# EasyEDA Pro project ProPrj_TPS双路降压模块_2025-07-25.epro

# Schematic Schematic1
Board Name: Board1; Create Date: 2025-07-24; Page Name: P1; Project Name: TPS双路降压模块; Schematic Name: Schematic1; Update Date: 2025-07-24; Company: 嘉立创EDA; Page Size: A4; Version: V1.0
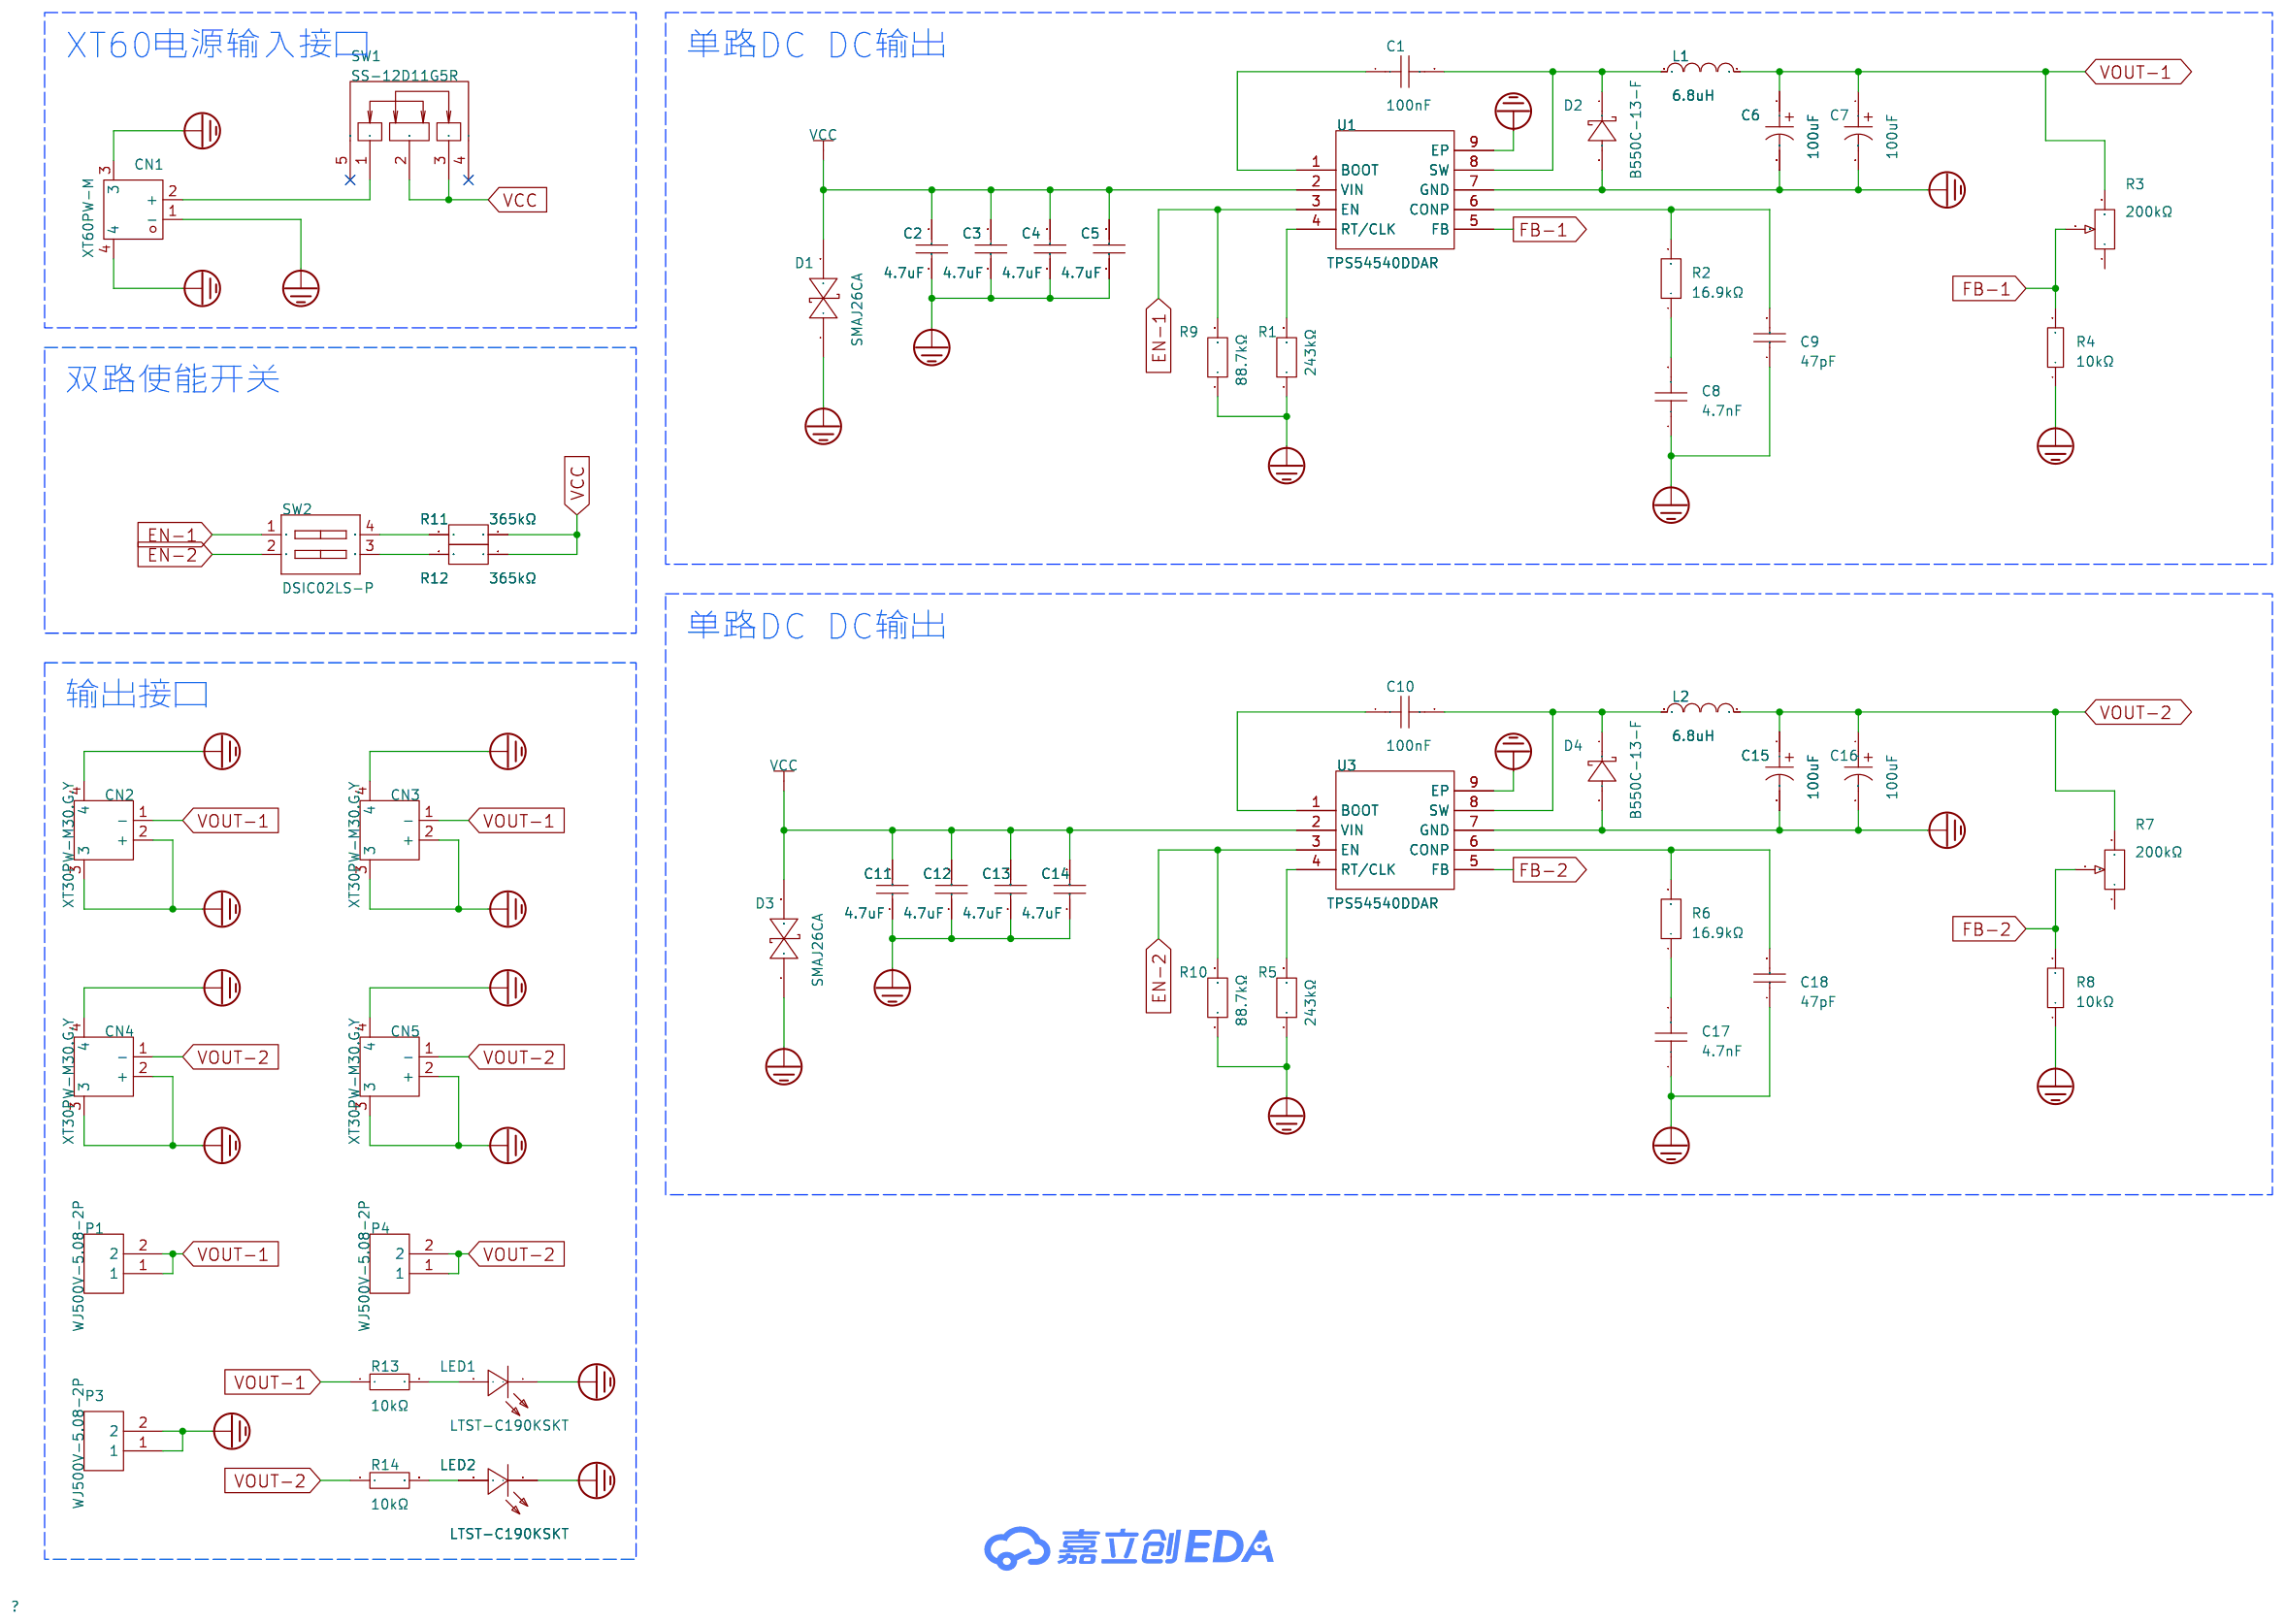
[diagram p0: schematic sheet]

## Parts
C1  100nF  [C0603]
C2  4.7uF  [C0805]
C3  4.7uF  [C0805]
C4  4.7uF  [C0805]
C5  4.7uF  [C0805]
C6  100uF  [CAP-TH_BD8.0-P3.50-D0.6-FD]
C7  100uF  [CAP-TH_BD8.0-P3.50-D0.6-FD]
C8  4.7nF  [C0603]
C9  47pF  [C0603]
C10  100nF  [C0603]
C11  4.7uF  [C0805]
C12  4.7uF  [C0805]
C13  4.7uF  [C0805]
C14  4.7uF  [C0805]
C15  100uF  [CAP-TH_BD8.0-P3.50-D0.6-FD]
C16  100uF  [CAP-TH_BD8.0-P3.50-D0.6-FD]
C17  4.7nF  [C0603]
C18  47pF  [C0603]
CN1  XT60PW-M  [CONN-TH_XT60PW-M]
CN2  XT30PW-M30.G.Y  [CONN-TH_XT30PW-M]
CN3  XT30PW-M30.G.Y  [CONN-TH_XT30PW-M]
CN4  XT30PW-M30.G.Y  [CONN-TH_XT30PW-M]
CN5  XT30PW-M30.G.Y  [CONN-TH_XT30PW-M]
D1  SMAJ26CA  [SMA_L4.4-W2.6-LS5.0-BI]
D2  B550C-13-F  [SMC_L6.9-W5.9-LS7.9-RD]
D3  SMAJ26CA  [SMA_L4.4-W2.6-LS5.0-BI]
D4  B550C-13-F  [SMC_L6.9-W5.9-LS7.9-RD]
L1  6.8uH  [IND-SMD_L7.0-W6.6]
L2  6.8uH  [IND-SMD_L7.0-W6.6]
LED1  LTST-C190KSKT  [LED0603-RD]
LED2  LTST-C190KSKT  [LED0603-RD]
P1  WJ500V-5.08-2P  [CONN-TH_2P-P5.00_WJ500V-5.08-2P]
P3  WJ500V-5.08-2P  [CONN-TH_2P-P5.00_WJ500V-5.08-2P]
P4  WJ500V-5.08-2P  [CONN-TH_2P-P5.00_WJ500V-5.08-2P]
R1  243kΩ  [R0603]
R2  16.9kΩ  [R0603]
R3  200kΩ  [RES-ADJ-TH_3P-L7.1-W6.9-P2.50-L_3362P]
R4  10kΩ  [R0603]
R5  243kΩ  [R0603]
R6  16.9kΩ  [R0603]
R7  200kΩ  [RES-ADJ-TH_3P-L7.1-W6.9-P2.50-L_3362P]
R8  10kΩ  [R0603]
R9  88.7kΩ  [R0603]
R10  88.7kΩ  [R0603]
R11  365kΩ  [R0603]
R12  365kΩ  [R0603]
R13  10kΩ  [R0603]
R14  10kΩ  [R0603]
SW1  SS-12D11G5R  [SW-TH_SS-12D11G5R]
SW2  DSIC02LS-P  [SW-SMD_4P-L5.1-W6.1-P2.54-LS9.8]
U1  TPS54540DDAR  [SOIC-8_L4.9-W3.9-P1.27-LS6.0-BL-EP]
U3  TPS54540DDAR  [SOIC-8_L4.9-W3.9-P1.27-LS6.0-BL-EP]

## Library data of the parts
C1 C10 = CGA0603X7R104K500JT: 容值:100nF;精度:±10%;额定电压:50V;温度系数:X7R;; LCSC Part Name: 100nF ±10% 50V; Supplier Part: C6119867; Manufacturer: HRE(芯声); Supplier Footprint: 0603; JLCPCB Part Class: 扩展库; Datasheet: https://atta.szlcsc.com/upload/public/pdf/source/20250103/C44077DA9E7B3EFAE02F22B6D3D1CBC9.pdf; Supplier: LCSC; Tolerance: ±10%; Voltage Rating: 50V; Temperature Coefficient: X7R
C2-C5 C11-C14 = CL21A475KBQNNNE: 容值:4.7uF;精度:±10%;额定电压:50V;材质(温度系数):X5R;; LCSC Part Name: 4.7uF ±10% 50V; Supplier Part: C98192; Manufacturer: SAMSUNG(三星); Supplier Footprint: 0805; JLCPCB Part Class: 扩展库; Datasheet: https://atta.szlcsc.com/upload/public/pdf/source/20160218/1457707763339.pdf; Supplier: LCSC; Tolerance: ±10%; Voltage Rated: 50V; Temperature Coefficient: X5R
C6 C7 C15 C16 = PA50V100M8x8: 容值:100uF;精度:±20%;额定电压:50V;纹波电流:2.9A@100kHz;等效串联电阻(ESR):30mΩ@100kHz;类型:聚合物;; LCSC Part Name: 100uF ±20% 50V; Supplier Part: C46550427; Manufacturer: 捷而瑞; Supplier Footprint: 插件,D8xL8mm; JLCPCB Part Class: 扩展库; Datasheet: https://atta.szlcsc.com/upload/public/pdf/source/20250307/831193F737CAF6D75AC25F14E955F0EC.pdf; Supplier: LCSC; Tolerance: ±20%; Voltage Rating: 50V; Ripple Current: 2.9A@100kHz; Equivalent Series Resistance(ESR): 30mΩ@100kHz; Type: 聚合物; Diameter: 8mm; Height - Seated (Max): 8mm; Lifetime: 2000hrs@105℃; Operating Temperature: -55℃~+105℃
C8 C17 = CGA0603X7R472K500JT: 容值:4.7nF;精度:±10%;额定电压:50V;温度系数:X7R;; LCSC Part Name: 4.7nF ±10% 50V; Supplier Part: C7503499; Manufacturer: HRE(芯声); Supplier Footprint: 0603; JLCPCB Part Class: 扩展库; Supplier: LCSC; Tolerance: ±10%; Voltage Rating: 50V; Temperature Coefficient: X7R
C9 C18 = CL10C470JB8NNNC: 容值:47pF;精度:±5%;额定电压:50V;材质(温度系数):C0G;; LCSC Part Name: 47pF ±5% 50V; Supplier Part: C1671; Manufacturer: SAMSUNG(三星); Supplier Footprint: 0603; JLCPCB Part Class: 基础库; Datasheet: https://atta.szlcsc.com/upload/public/pdf/source/20160218/1457707763339.pdf; Supplier: LCSC; Tolerance: ±5%; Voltage Rated: 50V; Temperature Coefficient: C0G
CN1 = XT60PW-M: 类别:-;类型1:-;; LCSC Part Name: AMASS(艾迈斯)航模插头xt60连接器150公母对接pw锂电池公头 板插卧式XT60PW-M; Supplier Part: C98732; Manufacturer: AMASS(艾迈斯); JLCPCB Part Class: 扩展库; Datasheet: https://atta.szlcsc.com/upload/public/pdf/source/20240118/44A3DCFF53BE25DC65378AFFB21277A4.pdf; Supplier: LCSC; Type: 卧式插头; Colour: 黄色; InterfaceType: 公头
CN2-CN5 = XT30PW-M30.G.Y: 类别:-;类型1:-;; LCSC Part Name: AMASS(艾迈斯)航模插头 卧式弯脚 XT30PW-M公头; Supplier Part: C431092; Manufacturer: AMASS(艾迈斯); JLCPCB Part Class: 扩展库; Datasheet: https://atta.szlcsc.com/upload/public/pdf/source/20220222/6A9F22F7850E25B33E1BE430ADF8560B.pdf; Supplier: LCSC; Type: 航模插头; RatedVoltage: DC 500V; InterfaceType: 公头; RatedCurrent: 15A; RecommendedWireGauge: 16/18/20AWG; contact resistance: 1.2mΩ; specifications: 2pin
D1 D3 = SMAJ26CA_C173517: 反向截止电压(Vrwm):26V;最大钳位电压:42.1V;峰值脉冲电流(Ipp)@10/1000us:9.5A;击穿电压:28.9V;; Supplier Part: C173517; Manufacturer: MDD; Supplier Footprint: SMA(DO-214AC); JLCPCB Part Class: 扩展库; Datasheet: https://atta.szlcsc.com/upload/public/pdf/source/20230314/4319D8044EE29783A53F6AC60595AA71.pdf; Supplier: LCSC; Reverse Stand-Off Voltage (Vrwm): 26V; Maximum Clamping Voltage: 42.1V; Peak Pulse Current (Ipp)@10/1000us: 9.5A; Breakdown Voltage: 28.9V; Reverse Leakage Current (Ir): 1uA; Type: TVS
D2 D4 = B550C-13-F: 二极管配置:-;正向压降(Vf):575mV@5A;直流反向耐压(Vr):50V;整流电流:5A;; LCSC Part Name: 电压:50V 电流:5A; Supplier Part: C134461; Manufacturer: DIODES(美台); Supplier Footprint: SMC(DO-214AB); JLCPCB Part Class: 扩展库; Datasheet: https://atta.szlcsc.com/upload/public/pdf/source/20171023/C134461_15087453602301052556.pdf; Supplier: LCSC; Forward Voltage (Vf@If): 575mV@5A; Reverse Voltage (Vr): 50V; Rectified Current: 5A; Reverse Leakage Current (Ir): 500uA@50V
L1 L2 = FXL0630-6R8-M: 电感值:6.8uH;精度:±20%;额定电流:5A;饱和电流(Isat):6A;类型:一体成型电感;; LCSC Part Name: 6.8uH ±20% 6A; Supplier Part: C167221; Manufacturer: cjiang(长江微电); Supplier Footprint: SMD,6.6x7mm; JLCPCB Part Class: 扩展库; Datasheet: https://atta.szlcsc.com/upload/public/pdf/source/20240426/3189EA8206330E2108542F9E34E540E7.pdf; Supplier: LCSC; Tolerance: ±20%; Rated Current: 5A; Saturation Current (Isat): 6A; DC Resistance (DCR): 48mΩ; Type: 一体成型电感
LED1 LED2 = LTST-C190KSKT: 发光颜色:黄色;正向电压(VF):2.1V;功率:75mW;正向电流:20mA;主波长:584.5nm~597nm;二极管配置:-;透镜颜色:无色透明透镜;色温:-;发光强度:104mcd;发光角度:130°;载带方式:-;工作温度:-30℃~+85℃;; LCSC Part Name: 黄灯; Supplier Part: C125095; Manufacturer: LITEON(光宝); Supplier Footprint: 0603; JLCPCB Part Class: 扩展库; Datasheet: https://atta.szlcsc.com/upload/public/pdf/source/20180129/C125095_15171881843821315881.pdf; Supplier: LCSC; Emitted Color: 黄色; Forward Voltage (VF): 2.1V; Power Dissipation: 75mW; Forward Current: 20mA; Dominant Wavelength: 584.5nm~597nm; Peak Wavelength: 588nm; Lens Color: 无色透明透镜; Luminous Intensity: 104mcd; Viewing Angle: 130°; Operating Temperature: -30℃~+85℃
P1 P3 P4 = WJ500V-5.08-2P: 结构:1x2P;间距:5.08mm;颜色:绿色;安装方式:直插;额定电流:18A;额定电压:250V;排数:1;线规 - AWG:14~30;线规 - 平方毫米:2.5;每排PIN数:2;触头材质:-;触头镀层:-;工作温度范围:-40℃~+105℃;焊接温度(最大值):-;; LCSC Part Name: 1x2P 5.08mm 直插 排数:1 每排P数:2; Supplier Part: C8465; Manufacturer: KANGNEX(康奈克斯电气); Supplier Footprint: 插件,P=5.08mm; JLCPCB Part Class: 扩展库; Datasheet: https://atta.szlcsc.com/upload/public/pdf/source/20191225/C8465_02D34CE5B5B4A53DF5891601D97FA9F4.pdf; Supplier: LCSC; Structure: 1x2P; Pitch: 5.08mm; Color: 绿色; Mounting Style: 直插; Current Rating (Max): 18A; Voltage Rating (Max): 250V; Number of Pins: 2P; Number of Rows: 1; Wire Gauge - AWG: 14~30; Wire Gauge - mm2: 2.5; Number of PINs Per Row: 2; Operating Temperature Range: -40℃~+105℃; Screw Specification: M2.5
R1 R5 = RT0603BRD07243KL: 电阻类型:薄膜电阻;阻值:243kΩ;精度:±0.1%;功率:100mW;温度系数:±25ppm/℃;; LCSC Part Name: 薄膜电阻 243kΩ ±0.1% 100mW; Supplier Part: C861248; Manufacturer: YAGEO(国巨); Supplier Footprint: 0603; JLCPCB Part Class: 扩展库; Datasheet: https://atta.szlcsc.com/upload/public/pdf/source/20200610/C326738_5639A9F1B6EB6E4AE2197577D3456E7F.pdf; Supplier: LCSC; Type: 薄膜电阻; Tolerance: ±0.1%; Power(Watts): 100mW; Temperature Coefficient: ±25ppm/℃; Operating Temperature: -55℃~+155℃
R2 R6 = RT0603BRD0716K9L: 电阻类型:薄膜电阻;阻值:16.9kΩ;精度:±0.1%;功率:100mW;温度系数:±25ppm/℃;; LCSC Part Name: 薄膜电阻 16.9kΩ ±0.1% 100mW; Supplier Part: C861156; Manufacturer: YAGEO(国巨); Supplier Footprint: 0603; JLCPCB Part Class: 扩展库; Datasheet: https://atta.szlcsc.com/upload/public/pdf/source/20200610/C326738_5639A9F1B6EB6E4AE2197577D3456E7F.pdf; Supplier: LCSC; Type: 薄膜电阻; Tolerance: ±0.1%; Power(Watts): 100mW; Temperature Coefficient: ±25ppm/℃; Operating Temperature Range: -55℃~+155℃
R3 R7 = 3362P-1-204: 阻值:200kΩ;精度:±10%;; LCSC Part Name: 200kΩ ±10%; Supplier Part: C118941; Manufacturer: BOCHEN(博晨); Supplier Footprint: 插件; JLCPCB Part Class: 扩展库; Datasheet: https://atta.szlcsc.com/upload/public/pdf/source/20171114/C118941_15106326619261117430.pdf; Supplier: LCSC; Tolerance: ±10%
R4 R8 R13 R14 = 0603WAF1002T5E: 电阻类型:厚膜电阻;阻值:10kΩ;精度:±1%;功率:100mW;工作电压:75V;温度系数:±100ppm/℃;; LCSC Part Name: 厚膜电阻 10kΩ ±1% 100mW; Supplier Part: C25804; Manufacturer: UNI-ROYAL(厚声); Supplier Footprint: 0603; JLCPCB Part Class: 基础库; Datasheet: https://atta.szlcsc.com/upload/public/pdf/source/20200306/C422600_1E6D84923E4A46A82E41ADD87F860B5C.pdf; Supplier: LCSC; Type: 厚膜电阻; Tolerance: ±1%; Power(Watts): 100mW; Voltage-Supply(Max): 75V; Temperature Coefficient: ±100ppm/℃; Operating Temperature: -55℃~+155℃
R9 R10 = FRC0603F8872TS: 电阻类型:厚膜电阻;阻值:88.7kΩ;精度:±1%;功率:100mW;最大工作电压:75V;温度系数:±100ppm/℃;; LCSC Part Name: 88.7kΩ ±1% 100mW 厚膜电阻; Supplier Part: C2999456; Manufacturer: FOJAN(富捷); Supplier Footprint: 0603; JLCPCB Part Class: 扩展库; Datasheet: https://atta.szlcsc.com/upload/public/pdf/source/20211221/925EC7D7225764EE0046F22065062C87.pdf; Supplier: LCSC; Type: 厚膜电阻; Tolerance: ±1%; Power(Watts): 100mW; Overload Voltage (Max): 75V; Temperature Coefficient: ±100ppm/℃
R11 R12 = RT0603BRE07365KL: 电阻类型:薄膜电阻;阻值:365kΩ;精度:±0.1%;功率:100mW;最大工作电压:75V;温度系数:±50ppm/℃;; LCSC Part Name: 薄膜电阻 365kΩ ±0.1% 100mW; Supplier Part: C705852; Manufacturer: YAGEO(国巨); Supplier Footprint: 0603; JLCPCB Part Class: 扩展库; Datasheet: https://atta.szlcsc.com/upload/public/pdf/source/20200720/C705852_E6A0549579C0A9487495768CA46BD90A.pdf; Supplier: LCSC; Type: 薄膜电阻; Tolerance: ±0.1%; Power(Watts): 100mW; Overload Voltage (Max): 75V; Temperature Coefficient: ±50ppm/℃; Operating Temperature Range: -55℃~+155℃
SW1 = SS-12D11G5R: 电路结构:单刀双掷;安装方式:弯插;开关颜色:黑色;额定电流(DC):5A;额定电压(DC):125V;额定电流(AC):5A;额定电压(AC):125V;机械寿命:1万次;; LCSC Part Name: 柄长5mm 弯插双档 滑动开关; Supplier Part: C388633; Manufacturer: XKB Connectivity(中国星坤); Supplier Footprint: 插件; JLCPCB Part Class: 扩展库; Datasheet: https://atta.szlcsc.com/upload/public/pdf/source/20211009/84F89DEF741E27E9E55DE4039DC07CAD.pdf; Supplier: LCSC; Circuit: 单刀双掷; Actuator Style: 矩形柱状; Pin Style: PC引脚; Switch Length: 13.5mm; Switch Width: 6.6mm; Switch Height: 6.3mm; Mounting Style: 弯插; Actuator Color: 黑色; Current Rating (DC): 5A; Voltage Rating (DC): 125V; Current Rating (AC): 5A; Voltage Rating (AC): 125V; Mechanical Life: 1万次; Operating Temperature: -40℃~+85℃
SW2 = DSIC02LS-P_C489174: 类型:平拨,凸起式;电路结构:单刀单掷;开关位数:2位;额定电流:25mA;额定电压:24V;使用寿命:3千次;颜色:黑色;; LCSC Part Name: 间距2.54mm 平拨,凸起式 2位拨码开关; Supplier Part: C489174; Manufacturer: XKB Connectivity(中国星坤); Supplier Footprint: SMD-4P,5.1x6.1mm; JLCPCB Part Class: 扩展库; Datasheet: https://atta.szlcsc.com/upload/public/pdf/source/20200227/C424380_7B5FE7C891E0521A8B96890FFC9096F0.pdf; Supplier: LCSC; Type: 平拨,凸起式; Circuit: 单刀单掷; Number of Positions: 2位; Pin Style: 鸥翼型; Lead Pitch: 2.54mm; Current Rating: 25mA; Voltage Rating: 24V; Operating Temperature: -20℃~+70℃; Operating Life: 3千次; Color: 黑色
U1 U3 = TPS54540DDAR: 功能类型:降压型;输出类型:可调;工作电压:4.5V~42V;输出电压:800mV~41.1V;输出电流:5A;; LCSC Part Name: 4.5V至42V输入、5A降压直流/直流转换器; Supplier Part: C95286; Manufacturer: TI(德州仪器); Supplier Footprint: SOIC-8-EP; JLCPCB Part Class: 扩展库; Datasheet: https://www.ti.com/cn/lit/gpn/tps54540; Supplier: LCSC; Function: 降压型; Output Type: 可调; Input Voltage: 4.5V~42V; Output Voltage: 800mV~41.1V; Output Current: 5A; Switching Frequency: 2.5MHz; Operating Temperature: -40℃~+150℃@(TJ); Synchronous Rectification: 否; Number of Outputs: 1; Topology: 降压式; Switch tube (built-in/external): 内置

## Nets
PGND: C2.1 C3.1 C4.1 C5.1 C6.2 C7.2 C8.1 C9.1 C11.1 C12.1 C13.1 C14.1 C15.2 C16.2 C17.1 C18.1 CN1.1(-) CN1.3 CN1.4 CN2.2(+) CN2.3 CN2.4 CN3.2(+) CN3.3 CN3.4 CN4.2(+) CN4.3 CN4.4 CN5.2(+) CN5.3 CN5.4 D1.1 D2.2(A) D3.1 D4.2(A) LED1.1(-) LED2.1(-) P3.1 P3.2 R1.1 R4.1 R5.1 R8.1 R9.1 R10.1 U1.7(GND) U1.9(EP) U3.7(GND) U3.9(EP)
VCC: C2.2 C3.2 C4.2 C5.2 C11.2 C12.2 C13.2 C14.2 D1.2 D3.2 R11.1 R12.1 SW1.2 SW1.3 U1.2(VIN) U3.2(VIN)
EN-1: R9.2 SW2.1(A1) U1.3(EN)
EN-2: R10.2 SW2.2(A2) U3.3(EN)
FB-1: R3.2 R4.2 U1.5(FB)
FB-2: R7.2 R8.2 U3.5(FB)
VOUT-1: C6.1 C7.1 CN2.1(-) CN3.1(-) L1.2 P1.1 P1.2 R3.3 R13.1
VOUT-2: C15.1 C16.1 CN4.1(-) CN5.1(-) L2.2 P4.1 P4.2 R7.3 R14.1
$1N288: CN1.2(+) SW1.1
$1N352: C1.1 U1.1(BOOT)
$1N358: C1.2 D2.1(C) L1.1 U1.8(SW)
$1N869: R1.2 U1.4(RT/CLK)
$1N1551: C8.2 R2.1
$1N1558: C9.2 R2.2 U1.6(CONP)
$1N2638: C10.1 U3.1(BOOT)
$1N2642: C10.2 D4.1(C) L2.1 U3.8(SW)
$1N2678: R5.2 U3.4(RT/CLK)
$1N2701: C17.2 R6.1
$1N2703: C18.2 R6.2 U3.6(CONP)
$1N3232: R11.2 SW2.4(B1)
$1N3236: R12.2 SW2.3(B2)
$1N4459: LED1.2(+) R13.2
$1N4463: LED2.2(+) R14.2

Not connected (* = marked no-connect by the designer): R3 1; R7 1; SW1 4* 5*

## Notes on the sheet
- XT60电源输入接口
- 单路DC DC输出
- 双路使能开关
- 单路DC DC输出
- 输出接口

# Board PCB1
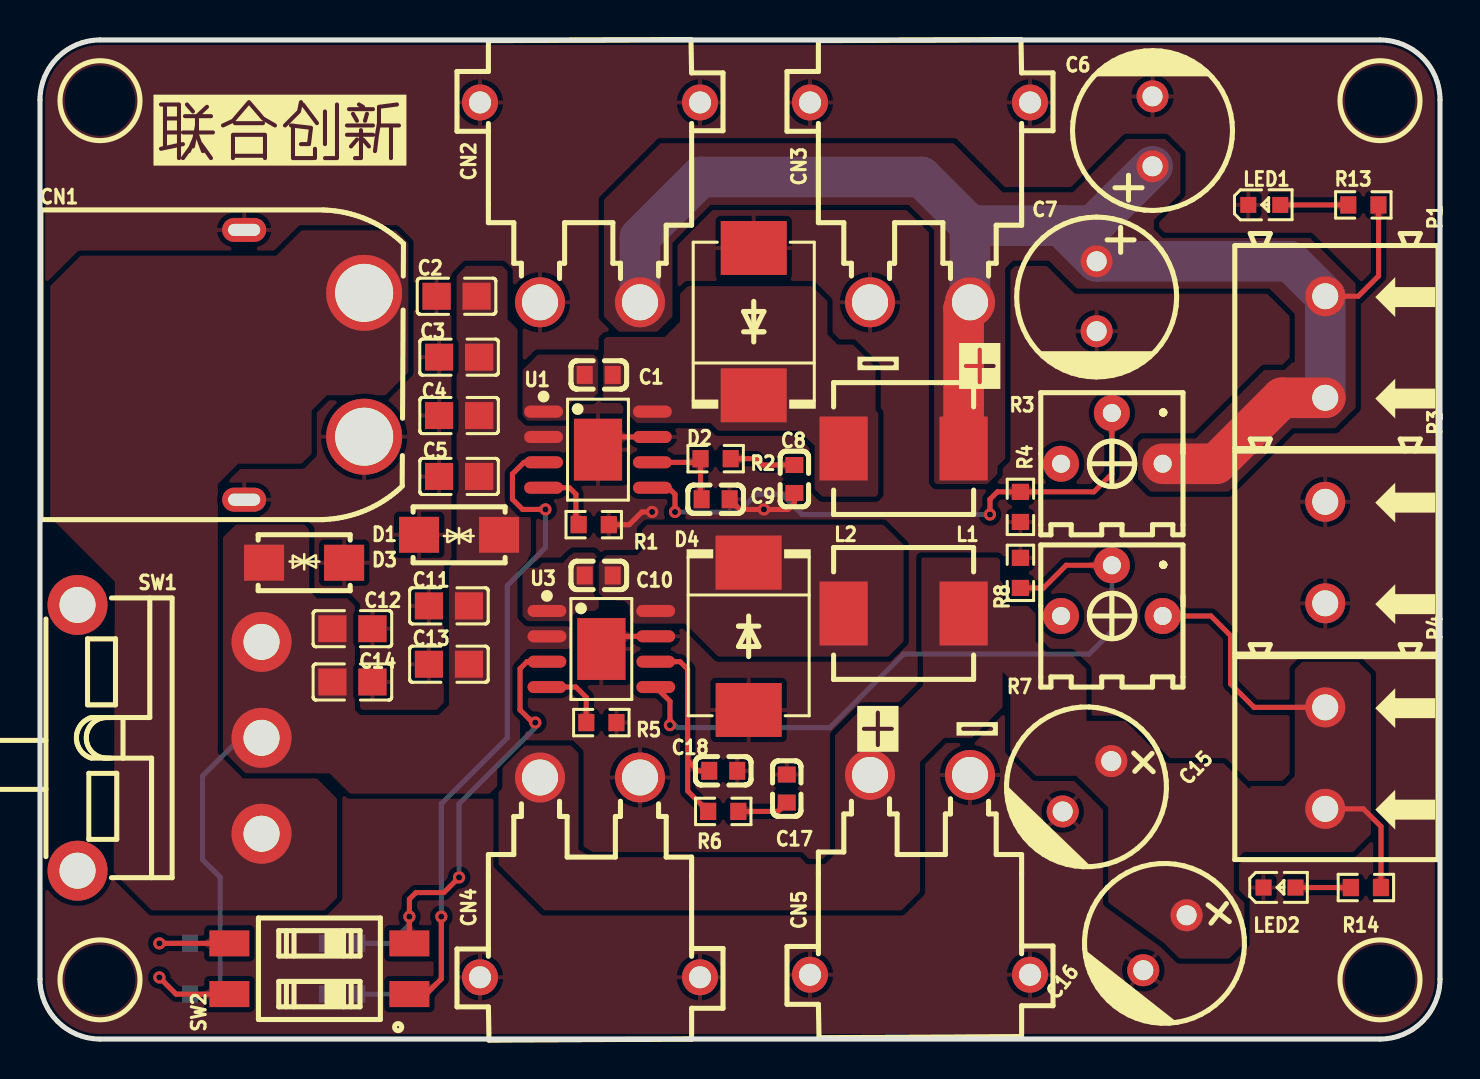
[diagram p1: board, top side]
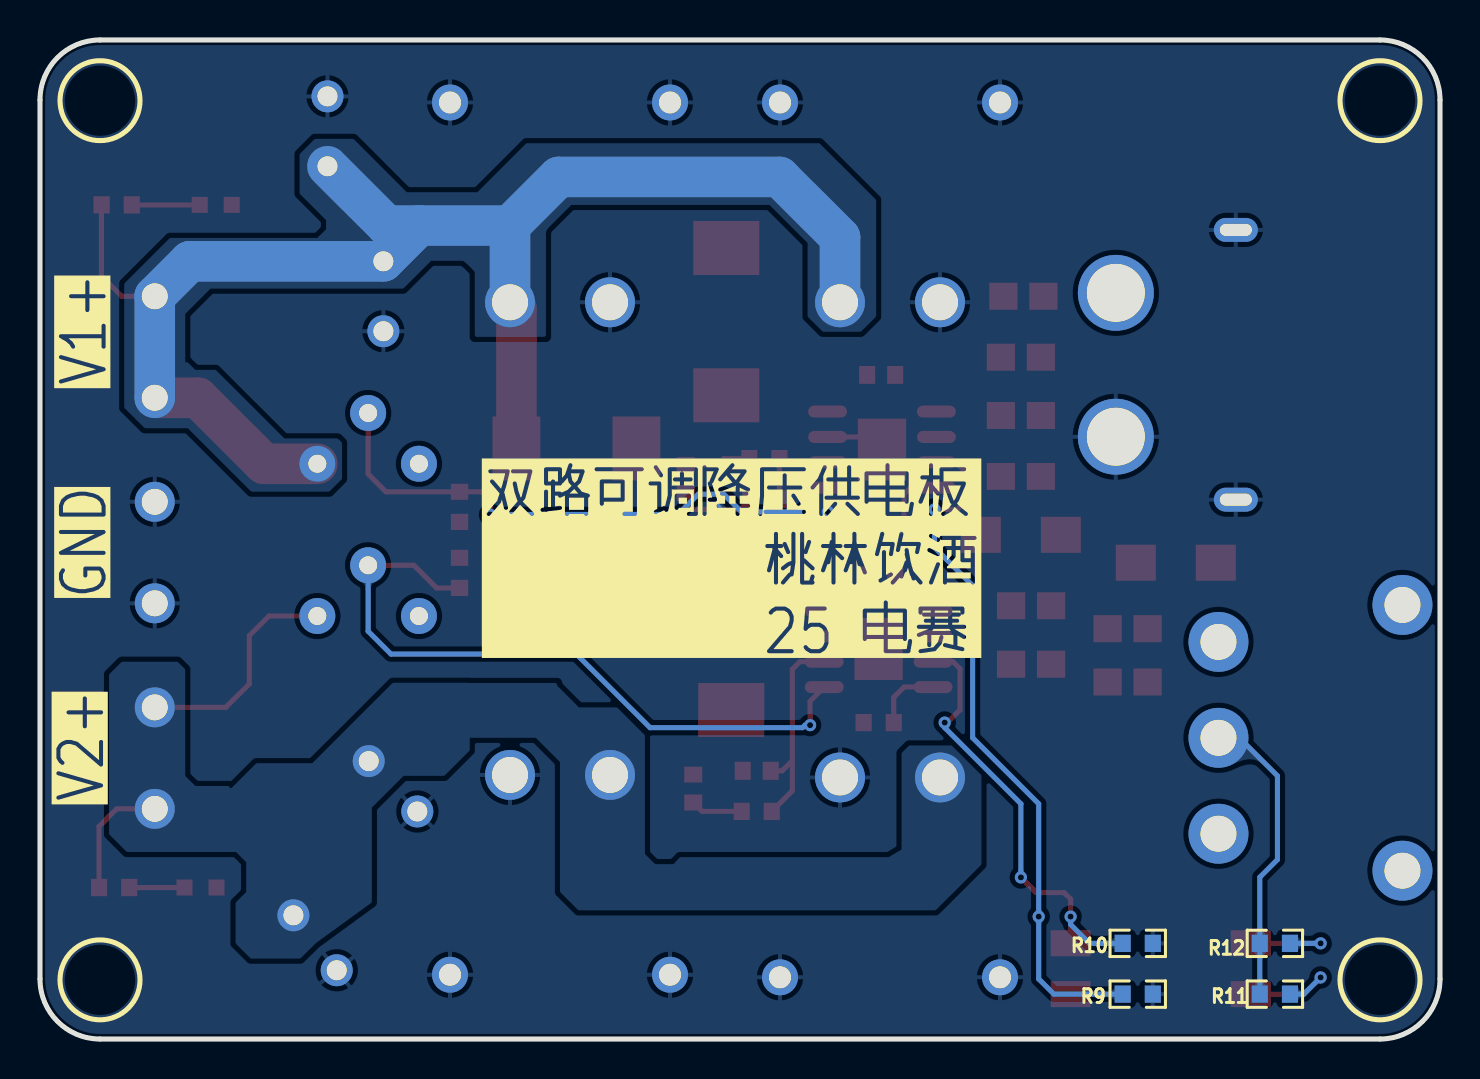
[diagram p2: board, bottom side, seen from below]

Outline 70 x 50 mm; copper layers: Top Layer, Bottom Layer. Coordinates in mm from the lower left corner of the outline.
Outline path: 0,47 0,3 arc(0.88,0.88) 3,0 67,0 arc(69.12,0.88) 70,3 70,47 arc(69.12,49.12) 67,50 3,50 arc(0.88,49.12) 0,47
Stack: Top Layer 0.035mm / Dielectric1 1.51mm FR4 er 4.5 / Bottom Layer 0.035mm

## Design rules (mm)
template: 自定义配置
spacing copperThickness1oz (default): track to track 0.102, other pairs 0.152 to 0.3
spacing copperThickness2oz: track to track 0.203, other pairs 0.152 to 0.3
track width copperThickness1oz (default): min 0.127, default 0.254, max 2.54
track width copperThickness2oz: min 0.203, default 0.254, max 2.54
differential pair differentialPair (default): width min 0.127, default 0.254, max 2.54; gap min 0.152, default 0.152
via viaSize (default): diameter min 0.5, default 0.61, max 10; hole min 0.3, default 0.305, max 6.3
net PGND uses copperRegion1

## Placement (name value [footprint] x y rotation side)
C1  100nF  [C0603]  27.94 33.24 0 top
C2  4.7uF  [C0805]  20.83 37.17 0 top
C3  4.7uF  [C0805]  20.96 34.12 0 top
C4  4.7uF  [C0805]  20.96 31.2 0 top
C5  4.7uF  [C0805]  20.96 28.16 0 top
C6  100uF  [CAP-TH_BD8.0-P3.50-D0.6-FD]  55.63 45.43 90 top
C7  100uF  [CAP-TH_BD8.0-P3.50-D0.6-FD]  52.83 37.17 270 top
C8  4.7nF  [C0603]  37.72 28.03 90 top
C9  47pF  [C0603]  33.78 27.01 180 top
C10  100nF  [C0603]  27.94 23.2 0 top
C11  4.7uF  [C0805]  20.45 21.68 0 top
C12  4.7uF  [C0805]  15.62 20.54 180 top
C13  4.7uF  [C0805]  20.45 18.76 0 top
C14  4.7uF  [C0805]  15.62 17.87 180 top
C15  100uF  [CAP-TH_BD8.0-P3.50-D0.6-FD]  52.35 12.65 226.1 top
C16  100uF  [CAP-TH_BD8.0-P3.50-D0.6-FD]  56.25 4.82 231.8 top
C17  4.7nF  [C0603]  37.34 12.53 270 top
C18  47pF  [C0603]  34.16 13.42 180 top
CN1  XT60PW-M  [CONN-TH_XT60PW-M]  13.21 33.74 0 top
CN2  XT30PW-M30.G.Y  [CONN-TH_XT30PW-M]  27.5 41.87 180 top
CN3  XT30PW-M30.G.Y  [CONN-TH_XT30PW-M]  44 41.87 180 top
CN4  XT30PW-M30.G.Y  [CONN-TH_XT30PW-M]  27.5 8.09 0 top
CN5  XT30PW-M30.G.Y  [CONN-TH_XT30PW-M]  44 8.22 0 top
D1  SMAJ26CA  [SMA_L4.4-W2.6-LS5.0-BI]  20.96 25.23 0 top
D2  B550C-13-F  [SMC_L6.9-W5.9-LS7.9-RD]  35.69 35.9 90 top
D3  SMAJ26CA  [SMA_L4.4-W2.6-LS5.0-BI]  13.21 23.84 180 top
D4  B550C-13-F  [SMC_L6.9-W5.9-LS7.9-RD]  35.43 20.15 270 top
L1  6.8uH  [IND-SMD_L7.0-W6.6]  43.18 29.55 0 top
L2  6.8uH  [IND-SMD_L7.0-W6.6]  43.18 21.3 0 top
LED1  LTST-C190KSKT  [LED0603-RD]  61.21 41.74 0 top
LED2  LTST-C190KSKT  [LED0603-RD]  61.98 7.58 0 top
P1  WJ500V-5.08-2P  [CONN-TH_2P-P5.00_WJ500V-5.08-2P]  64.26 34.63 270 top
P3  WJ500V-5.08-2P  [CONN-TH_2P-P5.00_WJ500V-5.08-2P]  64.26 24.35 270 top
P4  WJ500V-5.08-2P  [CONN-TH_2P-P5.00_WJ500V-5.08-2P]  64.26 14.06 270 top
R1  243kΩ  [R0603]  27.69 25.74 180 top
R2  16.9kΩ  [R0603]  33.78 29.04 180 top
R3  200kΩ  [RES-ADJ-TH_3P-L7.1-W6.9-P2.50-L_3362P]  53.59 30.06 0 top
R4  10kΩ  [R0603]  49.02 26.63 90 top
R5  243kΩ  [R0603]  28.07 15.84 180 top
R6  16.9kΩ  [R0603]  34.16 11.39 180 top
R7  200kΩ  [RES-ADJ-TH_3P-L7.1-W6.9-P2.50-L_3362P]  53.59 22.44 0 top
R8  10kΩ  [R0603]  49.02 23.33 270 top
R9  88.7kΩ  [R0603]  15.11 2.25 0 bottom
R10  88.7kΩ  [R0603]  15.11 4.79 0 bottom
R11  365kΩ  [R0603]  8.25 2.25 180 bottom
R12  365kΩ  [R0603]  8.25 4.79 180 bottom
R13  10kΩ  [R0603]  66.17 41.74 180 top
R14  10kΩ  [R0603]  66.29 7.58 180 top
SW1  SS-12D11G5R  [SW-TH_SS-12D11G5R]  6.48 15.07 90 top
SW2  DSIC02LS-P  [SW-SMD_4P-L5.1-W6.1-P2.54-LS9.8]  13.97 3.52 90 top
U1  TPS54540DDAR  [SOIC-8_L4.9-W3.9-P1.27-LS6.0-BL-EP]  27.9 29.5 270 top
U3  TPS54540DDAR  [SOIC-8_L4.9-W3.9-P1.27-LS6.0-BL-EP]  28.07 19.52 270 top

## Footprints (pads in the part's own frame, mm; a bottom-side part is the same pattern mirrored in y, then rotated)
C0603
  rect 0.8x0.9 smd: 1(-0.7,0) 2(0.7,0)
C0805
  rect 1.41x1.35 smd: 1(-1,0) 2(1,0)
CAP-TH_BD8.0-P3.50-D0.6-FD
  round 1.6 hole 1: 1(-1.75,0) 2(1.75,0)
CONN-TH_2P-P5.00_WJ500V-5.08-2P
  round 2 hole 1.3: 1(-2.54,0) 2(2.54,0)
CONN-TH_XT30PW-M
  round 2.5 hole 1.8: 1(-2.5,5) 2(2.5,5)
  round 1.8 hole 1.1: 3(5.5,-5) 4(-5.5,-5)
CONN-TH_XT60PW-M
  round 3.8 hole 2.9: 1(3,-3.6) 2(3,3.6)
  oval 2.2x1.2 hole 1.6x0.6: 3(-3,6.75) 4(-3,-6.75)
IND-SMD_L7.0-W6.6
  rect 2.4x3.2 smd: 1(-3,0) 2(3,0)
LED0603-RD
  rect 0.8x0.8 smd: 1(-0.799,0) 2(0.799,0)
R0603
  rect 0.806x0.864 smd: 1(-0.753,0) 2(0.753,0)
RES-ADJ-TH_3P-L7.1-W6.9-P2.50-L_3362P
  round 1.8 hole 0.9: 1(-2.54,-1.27) 2(0,1.27) 3(2.54,-1.27)
SMA_L4.4-W2.6-LS5.0-BI
  rect 2x1.8 smd: 1(-2,0) 2(2,0)
SMC_L6.9-W5.9-LS7.9-RD
  rect 2.7x3.3 smd: 1(-3.687,0) 2(3.687,0)
SOIC-8_L4.9-W3.9-P1.27-LS6.0-BL-EP
  oval 0.602x1.941 smd: 1(-1.905,-2.72) 2(-0.635,-2.72) 3(0.635,-2.72) 4(1.905,-2.72) 5(1.905,2.72) 6(0.635,2.72) 7(-0.635,2.72) 8(-1.905,2.72)
  rect 3.098x2.41 smd: 9(0,0)
SW-SMD_4P-L5.1-W6.1-P2.54-LS9.8
  rect 1.3x2 smd: 1(-1.27,-4.5) 2(1.27,-4.5) 3(1.27,4.5) 4(-1.27,4.5)
SW-TH_SS-12D11G5R
  round 3 hole 1.8: 1(-4.8,-4.6) 2(0,-4.6) 3(4.8,-4.6) 4(6.65,4.6) 5(-6.65,4.6)

## Nets
As in the schematic.

Pads without a net: R3 1; R7 1; SW1 4 5

## Via types
v1: diameter 0.61, hole 0.305, Top Layer to Bottom Layer, 12 vias

## Routing (per net, layer and track width the routed paths; a pad name or vN(x,y) marks a point on that pad's centre or on a via; arc(x,y) is an arc through that point)
PGND: length 10.8
  Top Layer w0.254: 37.72,27.33 37.72,26.82 37.4,26.5 v1(36.19,26.5) 34.99,26.5 C9.1 ; 28.4,30 28.53,30.13 U1.7 ; 30.79,20.15 28.7,20.15 28.57,20.02 ; v1(30.61,26.38) 30.1,26.38 29.46,25.74 28.69,25.74
VCC: length 15.1
  Bottom Layer w0.254: SW1.2 10.03,15.07 8.13,13.17 8.13,8.98 9.01,8.1 R12.1 9.01,2.37 8.88,2.25
EN-1: length 40.1
  Top Layer w0.254: v1(20.07,6.13) 20.07,3.01 19.3,2.25 SW2.1 ; U1.3 24.2,28.86 23.62,28.28 23.62,27.01 24.13,26.5 v1(25.27,26.5)
  Bottom Layer w0.254: v1(25.27,26.5) 25.27,24.6 23.37,22.69 23.37,15.07 20.07,11.77 v1(20.07,6.13) 20.07,3.01 19.3,2.25 R9.2
EN-2: length 22.4
  Top Layer w0.254: U3.3 24.35,18.88 24,18.54 24,16.47 24.64,15.84 v1(24.76,15.84) ; v1(20.96,8.09) 20.19,7.33 18.8,7.33 18.47,7 v1(18.47,6.13) SW2.2
  Bottom Layer w0.254: v1(18.47,6.13) 18.47,5.73 17.53,4.79 R10.2 ; v1(20.96,8.09) 20.96,11.77 24.76,15.58 v1(24.76,15.84)
FB-1: length 29.1
  Top Layer w0.254: v1(31.75,26.38) 31.75,27.27 31.43,27.59 U1.5 ; R3.2 53.59,28.28 52.7,27.39 R4.2 47.87,27.39 47.5,27.01 v1(47.5,26.25)
  Bottom Layer w0.254: v1(47.5,26.25) 38.1,26.25 37.08,27.27 35.81,27.27 34.93,26.38 v1(31.75,26.38)
FB-2: length 34.7
  Top Layer w0.254: R8.2 50.17,22.58 51.31,23.71 R7.2 ; v1(31.5,15.71) 31.5,16.91 U3.5
  Bottom Layer w0.254: v1(31.5,15.71) 31.75,15.71 31.88,15.58 39.5,15.58 43.18,19.27 52.45,19.27 53.59,20.41 R7.2
VOUT-1: length 79.7
  Top Layer w0.254: 66.67,41.74 66.93,41.48 66.93,38.19 65.91,37.17 P1.1
  Top Layer w2.032: P1.2 62.1,32.09 58.8,28.79 56.13,28.79 ; L1.2 46.18,36.55 CN3.1
  Bottom Layer w2.032: 51.04,40.71 C7.1 62.51,38.92 P1.1 P1.2 ; 51.04,40.71 46.5,40.71 ; 51.04,40.71 52.66,40.71 C6.1 ; 46.5,40.71 CN3.1 ; 46.5,40.71 44.07,43.14 33.02,43.14 30,40.12 CN2.1
VOUT-2: length 17.6
  Top Layer w0.254: P4.2 66.17,11.52 67.05,10.64 R14.1 ; P4.1 60.71,16.6 59.53,17.77 59.53,20.19 58.55,21.17 R7.3
$1N869: length 3.4
  Top Layer w0.254: U1.4 26.47,27.59 26.8,27.27 26.8,26.13 27.19,25.74
$1N1551: length 3.3
  Top Layer w0.254: R2.1 35.81,29.04 36.13,28.73 C8.2
$1N1558: length 4.5
  Top Layer w0.254: C9.2 33.03,27.07 R2.2 32.85,28.86 U1.6
$1N2678: length 3.4
  Top Layer w0.254: R5.2 27.31,17.1 26.8,17.61 U3.4
$1N2701: length 2.6
  Top Layer w0.254: C17.2 36.9,11.39 R6.1
$1N2703: length 10.6
  Top Layer w0.254: 32.38,13.93 32.38,18.5 32,18.88 U3.6 ; 32.38,13.93 32.38,12.42 R6.2 ; 32.38,13.93 32.89,13.42 C18.2
$1N3232: length 5.6
  Top Layer w0.254: v1(5.97,3.08) 6.8,2.25 SW2.4
  Bottom Layer w0.254: 7.37,2.25 6.8,2.25 v1(5.97,3.08)
$1N3236: length 5
  Top Layer w0.254: SW2.3 v1(5.97,4.79)
  Bottom Layer w0.254: v1(5.97,4.79) R12.2
$1N4459: length 3.5
  Top Layer w0.254: R13.2 61.89,41.74
$1N4463: length 2.8
  Top Layer w0.254: LED2.2 R14.2

## Copper pours and planes (outline as drawn; the poured copper is in the pictures)
PGND on Top Layer: -2.16,51.65 72.01,51.65 72.01,-1.94 -2.16,-1.94
PGND on Bottom Layer: -2.16,52.79 73.15,52.79 73.15,-2.2 -2.16,-2.2
VCC on Top Layer: 24.26,23.73 24.55,24.36 24.55,26.21 23.75,27.01 23.75,29.04 24,29.3 26.18,29.3 26.38,29.5 26.38,30.61 26.16,30.82 24.26,30.82 23.88,31.2 23.88,35.52 23.38,36.02 23.38,38.43 23.11,38.7 21.31,38.7 20.93,38.32 20.93,38.29 20.83,38.19 20.83,23.96 20.45,23.58 20.45,16.73 19.94,16.22 16,16.22 15.75,16.47 15.75,21.68 15.37,22.06 13.84,22.06 13.46,22.44 13.46,25.5 13.21,25.76 9.79,25.76 9.02,24.98 9.02,14.44 10.16,13.3 14.48,13.3 15.49,12.28 22.48,12.28 22.86,12.66 22.86,13.68 24,14.82 24,19.14 24.38,19.52 26.42,19.52 26.55,19.65 26.55,20.51 26.29,20.77 26.29,20.79 24.38,20.79 24.26,20.92
VOUT-1 on Top Layer: 30.86,35.39 28.96,35.39 28.19,36.16 28.19,42 31.03,44.83 45.68,44.83 48.13,42.38 51.66,42.38 54.32,45.05 56.26,45.05 57.02,44.28 57.02,42.31 55.7,40.98 55.7,40.53 56.13,40.09 63.5,40.09 65.79,37.81 65.79,31.59 64.76,30.57 62.61,30.57 59.44,27.39 55.53,27.39 54.9,28.03 54.9,29.84 55.12,30.06 57.78,30.06 61.21,33.49 62.23,33.49 62.61,33.87 62.74,33.87 62.74,36.28 61.47,37.55 51.84,37.55 50.44,38.95 48.64,38.95 48.26,38.57 48.26,29.04 47.88,28.66 47.88,28.28 47.37,27.77 44.81,27.77 44.7,27.88 44.7,40.47 43.43,41.74 33.53,41.74 31.62,39.84 31.62,36.16
VOUT-1 on Bottom Layer: 30.86,35.39 28.96,35.39 28.19,36.16 28.19,42 31.03,44.83 45.68,44.83 48.13,42.38 51.66,42.38 54.32,45.05 56.26,45.05 57.02,44.28 57.02,42.31 55.7,40.98 55.7,40.53 56.13,40.09 63.5,40.09 65.79,37.81 65.79,31.59 64.76,30.57 62.61,30.57 59.44,27.39 55.53,27.39 54.9,28.03 54.9,29.84 55.12,30.06 57.78,30.06 61.21,33.49 62.23,33.49 62.61,33.87 62.74,33.87 62.74,36.28 61.47,37.55 51.84,37.55 50.44,38.95 48.64,38.95 48.26,38.57 48.26,35.14 44.7,35.14 44.7,40.47 43.43,41.74 33.53,41.74 31.62,39.84 31.62,36.16
VOUT-2 on Top Layer: 39.24,8.75 38.33,8.75 38,9.11 27.56,9.11 26.92,9.49 26.92,14.31 26.54,14.69 23.75,14.69 23.62,14.57 23.75,14.57 22.93,13.74 22.93,8.73 25.22,6.44 43.08,6.44 44,7.36 44,13.86 45.21,15.07 46.61,15.07 48.13,16.6 48.13,22.82 47.5,23.46 44.14,23.46 44.14,17.69 43.05,16.6 41.15,16.6 39.75,15.2 39.75,9.26
VOUT-2 on Top Layer: 47.88,24.09 44.07,24.09 44.07,19.39 44.58,18.88 47.62,18.88 48.51,18 48.51,14.44 49.78,13.17 51.82,13.17 53.41,11.58 53.41,6.83 56.22,4.79 56.98,4.03 59.46,4.03 60.22,4.79 60.22,6.82 59.69,7.36 59.69,8.85 60.2,9.36 65.66,9.36 66.55,10.25 66.55,18.25 65.91,18.88 63.12,18.88 62.74,18.5 62.74,13.17 62.23,12.66 60.58,12.66 60.45,12.53 59.18,13.8 56.39,13.8 54.27,15.93 52.32,15.93 52.32,18.51 51.56,19.27 50.41,19.27 49.78,19.9 49.78,21.3 49.4,21.68 48.26,21.68 48.01,21.93 48.01,23.96
VOUT-2 on Bottom Layer: 39.24,8.75 38.33,8.75 38,9.11 27.56,9.11 26.92,9.49 26.92,14.31 26.54,14.69 23.75,14.69 23.62,14.57 23.75,14.57 22.93,13.74 22.93,8.73 25.22,6.44 43.08,6.44 44,7.36 44,13.86 45.21,15.07 50.49,15.07 50.49,17.82 44.14,17.82 44.14,17.69 43.05,16.6 41.15,16.6 39.75,15.2 39.75,9.26
VOUT-2 on Bottom Layer: 48.51,17.83 48.51,14.44 49.78,13.17 51.82,13.17 53.41,11.58 53.41,6.83 56.22,4.79 56.98,4.03 59.46,4.03 60.22,4.79 60.22,6.82 59.69,7.36 59.69,8.85 60.2,9.36 65.66,9.36 66.55,10.25 66.55,18.25 65.91,18.88 63.12,18.88 62.74,18.5 62.74,13.17 62.23,12.66 60.58,12.66 60.45,12.53 59.18,13.8 56.39,13.8 52.36,17.83
$1N288 on Top Layer: 13.08,40.47 11.81,39.2 2.03,39.2 0.51,37.68 0.51,26.12 3.75,22.89 3.68,8.34 5.59,6.44 14.22,6.44 14.86,7.07 14.86,12.03 13.84,13.04 10.16,13.04 8.89,14.31 8.89,27.77 9.91,28.79 13.08,28.79 13.59,29.3 13.59,31.46 14.35,32.22 17.27,32.22 18.41,33.36 18.41,39.84 17.78,40.47
$1N352 on Top Layer: 24.89,34.25 24.13,33.49 24.13,31.2 24.38,30.95 26.29,30.95 26.42,31.08 26.42,31.71 26.73,32.02 27.61,32.02 27.9,32.32 27.9,34.04 27.69,34.25
$1N358 on Top Layer: 28.19,34.25 28.07,34.12 28.07,32.22 28.19,32.09 29.09,32.09 29.42,31.76 29.42,31.25 29.84,30.82 33.53,30.82 33.91,30.44 37.97,30.44 38.74,29.68 38.74,27.52 39.12,27.14 41.78,27.14 41.91,27.27 41.91,31.33 41.78,31.46 41.78,33.62 40.64,34.76 39.88,34.76 39.37,35.27 39.37,36.92 38.61,37.68 32.38,37.68 32,37.3 32,35.9 31.24,35.14 28.32,35.14 28.19,35.01
$1N2638 on Top Layer: 26.55,24.26 26.16,23.87 26.16,23.84 25.12,23.84 24.87,23.58 24.38,23.58 24.13,23.33 24.13,21.17 24.38,20.92 26.54,20.92 26.92,21.3 26.92,21.42 27.77,21.42 27.94,21.6 27.94,24.09 27.69,24.35 26.67,24.35 26.55,24.23
$1N2642 on Top Layer: 28.32,24.22 27.94,23.84 27.94,22.33 28.22,22.05 28.72,22.05 28.83,21.93 29.21,21.93 29.46,21.68 29.46,21.04 29.72,20.79 32.26,20.79 33.91,19.14 42.42,19.14 43.18,19.9 43.18,24.73 42.16,25.74 30.35,25.74 30.1,25.49 30.1,24.47 29.84,24.22

Small or netless copper shapes (teardrops, artwork), in the pictures only: 64 on Top Layer, 22 on Bottom Layer

## Text on the board
Bottom Silkscreen Layer: V1+ | GND | V2+ | 双路可调降压供电板 / 桃林饮酒 / 25 电赛
Top Silkscreen Layer: + | - | 联合创新
